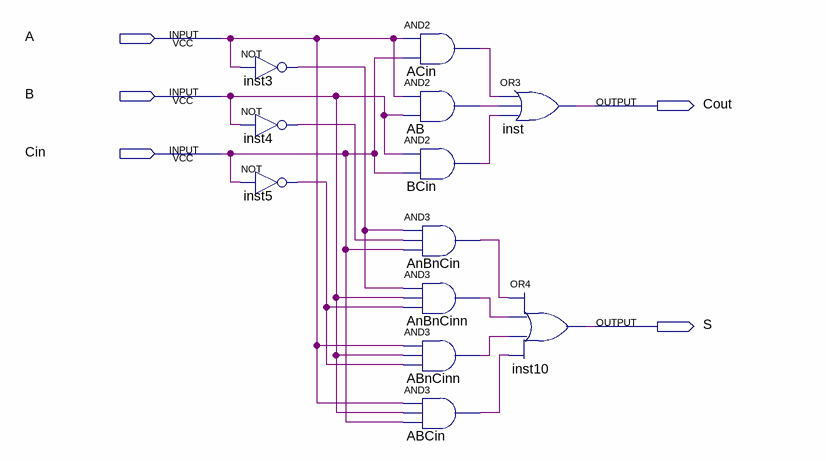
[diagram p0: schematic sheet]
// Quartus schematic OneBitAdderOLD.bdf as structural Verilog: 12 symbols, 5 pins
module OneBitAdderOLD (
  input  A,
  input  B,
  input  Cin,
  output Cout,
  output S
);

  wire AB_out, ABCin_out, ABnCinn_out, ACin_out, AnBnCin_out, AnBnCinn_out, BCin_out, inst3_out, inst4_out,
       inst5_out;

  not inst3 (inst3_out, A);
  not inst4 (inst4_out, B);
  not inst5 (inst5_out, Cin);
  and ACin (ACin_out, A, Cin);
  and AB (AB_out, A, B);
  and BCin (BCin_out, B, Cin);
  and AnBnCin (AnBnCin_out, inst3_out, inst4_out, Cin);
  and AnBnCinn (AnBnCinn_out, inst3_out, B, inst5_out);
  and ABnCinn (ABnCinn_out, A, B, inst5_out);
  and ABCin (ABCin_out, A, B, Cin);
  or inst (Cout, ACin_out, AB_out, BCin_out);
  or inst10 (S, AnBnCin_out, AnBnCinn_out, ABnCinn_out, ABCin_out);
endmodule
